# EAGLE design SingleResistor (EAGLE 9.6.2)
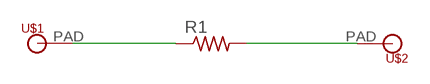
[diagram p0: schematic, sheet 1]

## Parts
R1  R-US_VMTB60  [VMTB60]
U$1  MICROBIT_PAD  [MICROBIT_PAD]
U$2  MICROBIT_PAD  [MICROBIT_PAD]

## Nets
N$1: R1.1 U$1.PAD
N$2: R1.2 U$2.PAD

## Library data of the parts
R1 = rcl:R-US_: RESISTOR, American symbol; SPICEPREFIX: R
U$1 U$2 = microbit:MICROBIT_PAD

## Board
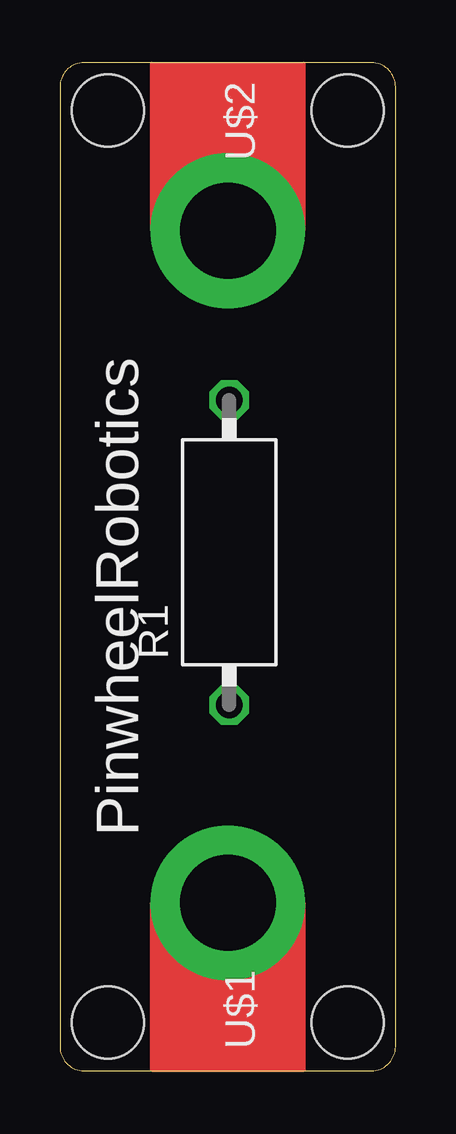
[diagram p1: board, top side]
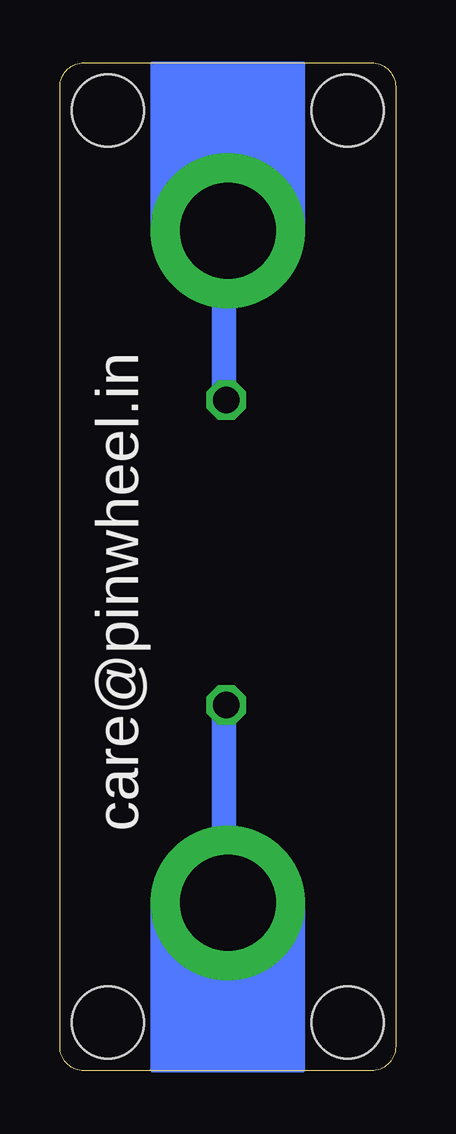
[diagram p2: board, bottom side, seen from below]

Size 14 x 42 mm. Coordinates in mm from the lower left corner, seen from the top.
Outline: 13,42 1,42 arc90 0,41 0,1 arc90 1,0 13,0 arc90 14,1 14,41 arc90 13,42
Copper layers (1*16): Top 0.035mm / dielectric 1.5mm / Bottom 0.035mm
Design rules "default": minimum track width 6mil, minimum drill 0.35mm, track to track 6mil, track to pad 6mil, pad to pad 6mil, via to via 6mil, smd to smd 6mil, copper to edge 40mil, drill to drill 6mil, minimum pad ring 10mil, minimum via ring 8mil, stop-mask expansion 4mil, vias tented up to drill 0mil, thermal gap 10mil
Holes 3 mm at 2,40 12,40 2,2 12,2

### Footprints (pad centres in the part's own frame; a part is rotated, then mirrored left to right if it is on the bottom)
VMTB60 = drill 1.1 octagon: 1 -6.35,0; 2 6.35,0
MICROBIT_PAD = drill 4 pad 6.452: PAD 0,0

### Placement (x,y rotation side)
R1  7.06,21.59 90 top
U$1  7,6.99 0 top
U$2  7,35 180 top

### Tracks (layer width: path | path; a pad name or v marks a point on that pad's centre or on a via)
N$1
  Bottom 0.152: 7.16,15.24 R1.1 | 7.16,7.01 U$1.PAD
  Bottom 1.016: 7.16,7.01 7.16,15.24
N$2
  Bottom 0.152: 7.16,28.04 R1.2 | 7.16,34.9 U$2.PAD
  Bottom 1.016: 7.16,34.9 7.16,28.04

### Text on the board
tPlace: PinwheelRobotics
bPlace: care@pinwheel.in